# EAGLE design MrMIDI L1 (EAGLE 6.6.0)
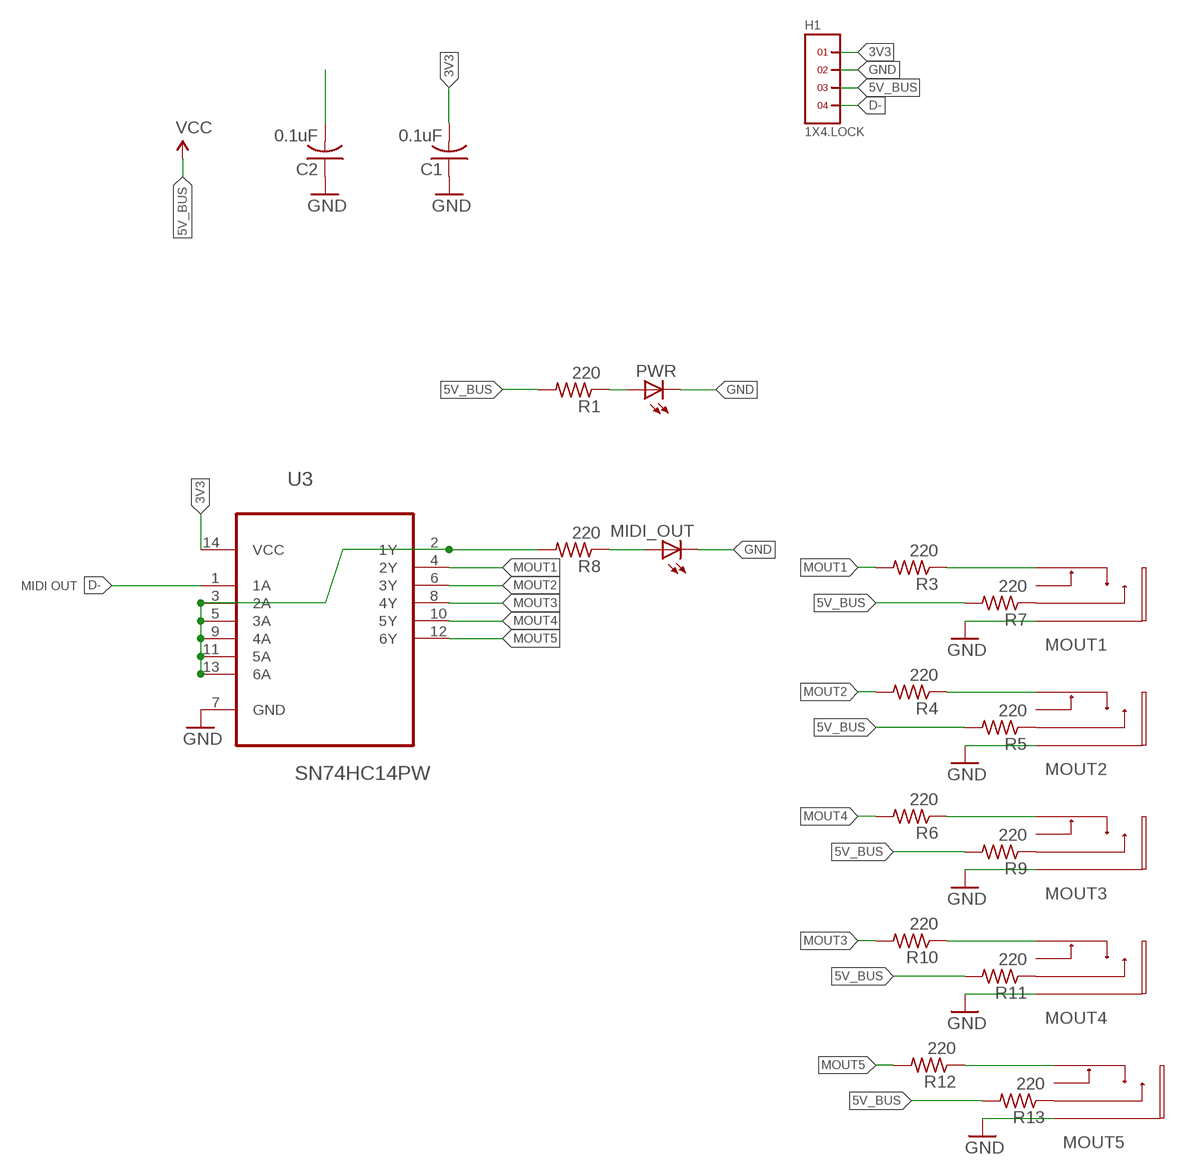
[diagram p0: schematic, sheet 1]

## Parts
C1  0.1uF  RCL_C-USC0603K  [RCL_C0603K]
C2  0.1uF  RCL_C-USC0603K  [RCL_C0603K]
H1  1X4.LOCK  [1X4.LOCK]
MIDI_OUT  LEDCHIPLED_0603  [CHIPLED_0603]
MOUT1  PJ327E  [PJ327]
MOUT2  PJ327E  [PJ327]
MOUT3  PJ327E  [PJ327]
MOUT4  PJ327E  [PJ327]
MOUT5  PJ327E  [PJ327]
PWR  LEDCHIPLED_0603  [CHIPLED_0603]
R1  220  RCL_R-US_R0402  [RCL_R0402]
R3  220  RCL_R-US_R0402  [RCL_R0402]
R4  220  RCL_R-US_R0402  [RCL_R0402]
R5  220  RCL_R-US_R0402  [RCL_R0402]
R6  220  RCL_R-US_R0402  [RCL_R0402]
R7  220  RCL_R-US_R0402  [RCL_R0402]
R8  220  RCL_R-US_R0402  [RCL_R0402]
R9  220  RCL_R-US_R0402  [RCL_R0402]
R10  220  RCL_R-US_R0402  [RCL_R0402]
R11  220  RCL_R-US_R0402  [RCL_R0402]
R12  220  RCL_R-US_R0402  [RCL_R0402]
R13  220  RCL_R-US_R0402  [RCL_R0402]
U3  SN74HC14PW  [SOP65P640X120-14N]

## Nets
3V3: C1.2 H1.1 U3.14(VCC)
5V_BUS: C2.2 H1.3 R1.2 R5.2 R7.2 R9.2 R11.2 R13.2 ; supply symbol labelled VCC
D-: H1.4 U3.1(1A)
GND: C1.1 C2.1 H1.2 MIDI_OUT.C MOUT1.P$1 MOUT1.P$4 MOUT2.P$1 MOUT2.P$4 MOUT3.P$1 MOUT3.P$4 MOUT4.P$1 MOUT4.P$4 MOUT5.P$1 MOUT5.P$4 PWR.C U3.7(GND)
MOUT1: R3.2 U3.4(2Y)
MOUT2: R4.2 U3.6(3Y)
MOUT3: R10.2 U3.8(4Y)
MOUT4: R6.2 U3.10(5Y)
MOUT5: R12.2 U3.12(6Y)
N$1: MIDI_OUT.A R8.1
N$3: MOUT5.P$3 R13.1
N$6: R8.2 U3.2(1Y) U3.3(2A) U3.5(3A) U3.9(4A) U3.11(5A) U3.13(6A)
N$7: MOUT1.P$3 R7.1
N$8: MOUT1.P$2 R3.1
N$9: MOUT2.P$3 R5.1
N$10: MOUT2.P$2 R4.1
N$11: MOUT3.P$3 R9.1
N$12: MOUT3.P$2 R6.1
N$13: MOUT4.P$3 R11.1
N$14: MOUT4.P$2 R10.1
N$17: MOUT5.P$2 R12.1
N$21: PWR.A R1.1
Unconnected: MOUT1.P$5 MOUT2.P$5 MOUT3.P$5 MOUT4.P$5 MOUT5.P$5

## Notes on the sheet
- MIDI OUT

## Library data of the parts
C1 C2 = ioboard:RCL_C-US: CAPACITOR, American symbol
H1 = headers(.1in):1X4
MIDI_OUT PWR = led:LED: LED OSRAM: - CHIPLED LG R971, LG N971, LY N971, LG Q971, LY Q971, LO R971, LY R971 LH N974, LH R974 LS Q976, LO Q976, LY Q976 LO Q996 - Hyper CHIPLED LW Q18S LB Q993, LB Q99A, LB R99A - SideLED LS A670, LO A670, LY A670, LG A670, LP A670 LB A673, LV A673, LT A673, LW A673 LH A674 LY A675 LS A676, LA A676, LO A676, LY A676, LW A676 LS A679, LY A679, LG A679 - Hyper Micro SIDELED® LS Y876, LA Y876, LO Y876, LY Y876 LT Y87S - SmartLED LW L88C, LW L88S LB L89C, LB L89S, LG L890 LS L89K, LO L89K, LY L89K LS L896, LA L896, LO L896, LY L896 - TOPLED LS T670, LO T670, LY T670, LG T670, LP T670 LSG T670, LSP T670, LSY T670, LOP T670, LYG T670 LG T671, LOG T671, LSG T671 LB T673, LV T673, LT T673, LW T673 LH T674 LS T676, LA T676, LO T676, LY T676, LB T676, LH T676, LSB T676, LW T676 LB T67C, LV T67C, LT T67C, LS T67K, LO T67K, LY T67K, LW E67C LS E67B, LA E67B, LO E67B, LY E67B, LB E67C, LV E67C, LT E67C LW T67C LS T679, LY T679, LG T679 LS T770, LO T770, LY T770, LG T770, LP T770 LB T773, LV T773, LT T773, LW T773 LH T774 LS E675, LA E675, LY E675, LS T675 LS T776, LA T776, LO T776, LY T776, LB T776 LHGB T686 LT T68C, LB T68C - Hyper Mini TOPLED® LB M676 - Mini TOPLED Santana® LG M470 LS M47K, LO M47K, LY M47K Source: http://www.osram.convergy.de LUXEON: - LUMILED® LXK2-PW12-R00, LXK2-PW12-S00, LXK2-PW14-U00, LXK2-PW14-V00 LXK2-PM12-R00, LXK2-PM12-S00, LXK2-PM14-U00 LXK2-PE12-Q00, LXK2-PE12-R00, LXK2-PE12-S00, LXK2-PE14-T00, LXK2-PE14-U00 LXK2-PB12-K00, LXK2-PB12-L00, LXK2-PB12-M00, LXK2-PB14-N00, LXK2-PB14-P00, LXK2-PB14-Q00 LXK2-PR12-L00, LXK2-PR12-M00, LXK2-PR14-Q00, LXK2-PR14-R00 LXK2-PD12-Q00, LXK2-PD12-R00, LXK2-PD12-S00 LXK2-PH12-R00, LXK2-PH12-S00 LXK2-PL12-P00, LXK2-PL12-Q00, LXK2-PL12-R00 Source: www.luxeon.com KINGBRIGHT: KA-3528ASYC Source: www.kingbright.com
MOUT1-MOUT5 = 0Raph's Lib:PJ327E
R1 R3-R13 = warps_v30:RCL_R-US_: RESISTOR, American symbol
U3 = Raph's Lib:SN74HC14PW: HEX SCHMITT-TRIGGER INVERTERS; MPN: SN74HC14PW; OC_FARNELL: 9591133; OC_NEWARK: 02H5414; PACKAGE: TSSOP-14; SUPPLIER: Texas Instruments

## Board
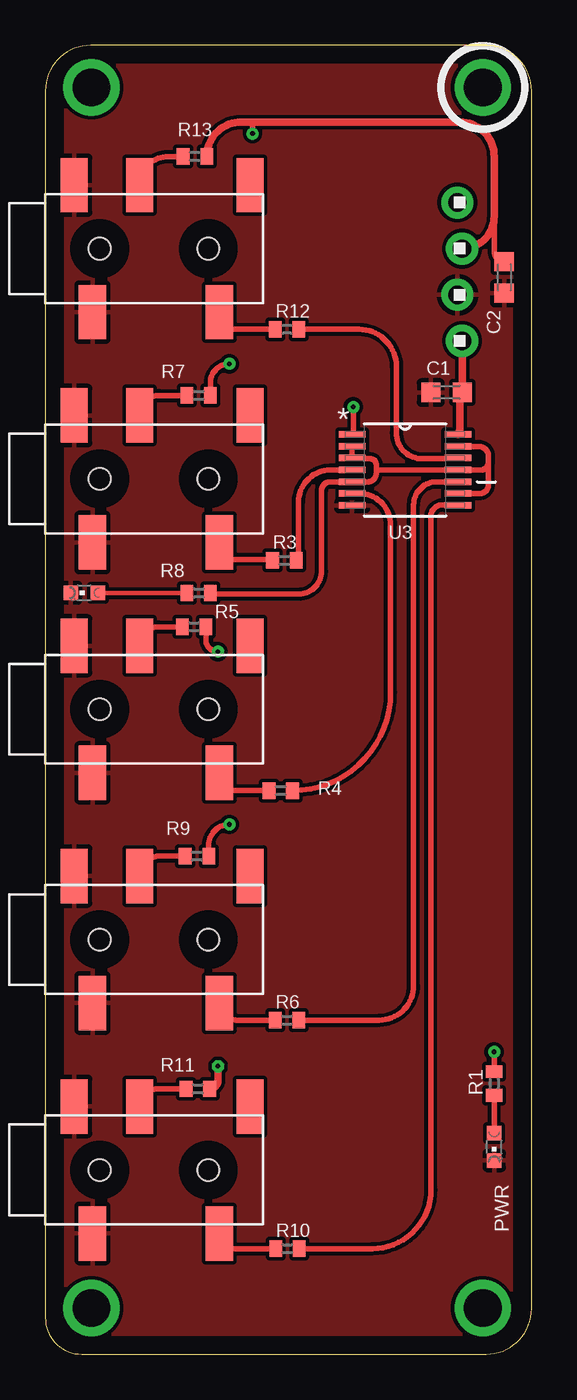
[diagram p1: board, top side]
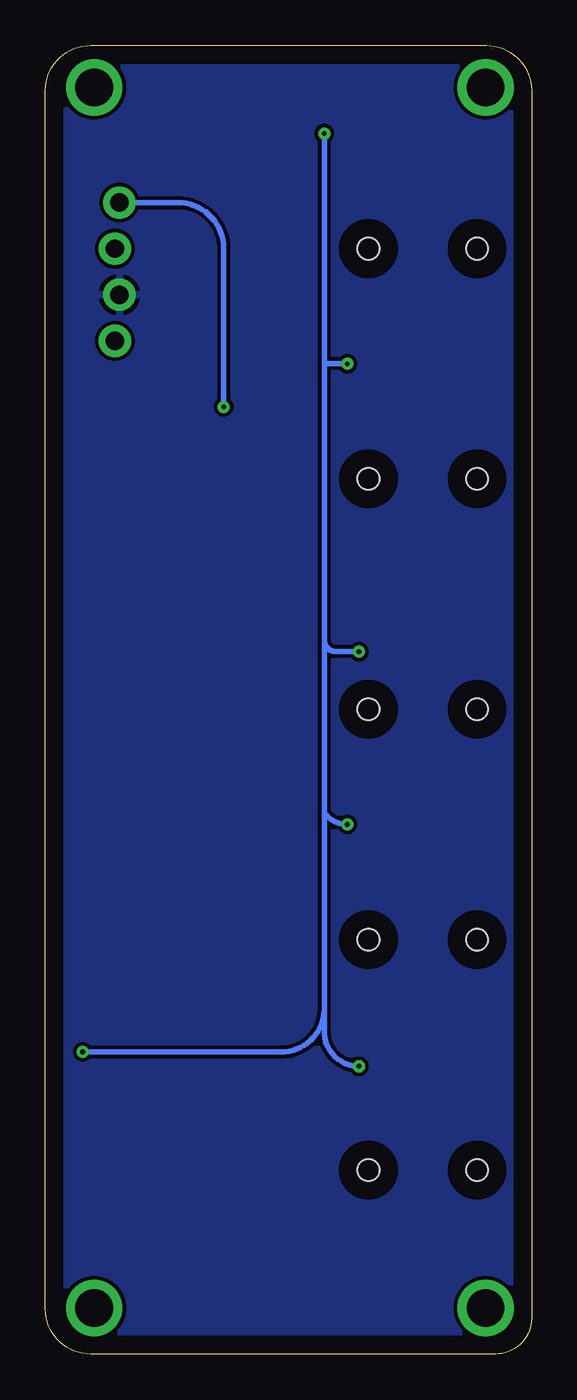
[diagram p2: board, bottom side, seen from below]

Size 26.82 x 72.17 mm. Coordinates in mm from the lower left corner, seen from the top.
Outline: 2,0 24.32,0 arc90 26.82,2.5 26.82,69.67 arc90 24.32,72.17 2.5,72.17 arc90 0,69.67 0,2 arc90 2,0
Copper layers (1*16): Top 0.035mm / dielectric 1.5mm / Bottom 0.035mm
Design rules "default": minimum track width 10mil, minimum drill 24mil, track to track 8mil, track to pad 8mil, pad to pad 8mil, via to via 8mil, smd to smd 8mil, copper to edge 40mil, drill to drill 8mil, minimum pad ring 10mil, minimum via ring 8mil, stop-mask expansion 4mil, vias tented up to drill 25mil, thermal gap 10mil

### Footprints (pad centres in the part's own frame; a part is rotated, then mirrored left to right if it is on the bottom)
RCL_C0603K = smd 1.05 x 1.08: 1 -0.875,0; 2 0.875,0
1X4.LOCK = drill 1.016 pad 1.778: 1 0,-0.127; 2 2.54,0.127; 3 5.08,-0.127; 4 7.62,0.127
CHIPLED_0603 = smd 0.8 x 0.8: A 0,-0.75; C 0,0.75
PJ327 = smd 1.5 x 3: P$1 1.6,3.5; P$2 9.6,-3.5; P$3 5.2,3.5; P$4 2.6,-3.5; P$5 11.3,3.5 | hole 1.2: 3,0; 9,0
RCL_R0402 = smd 0.7 x 0.9: 1 -0.65,0; 2 0.65,0
SOP65P640X120-14N = smd 1.473 x 0.356: 1 -2.921,1.956; 2 -2.921,1.295; 3 -2.921,0.66; 4 -2.921,0; 5 -2.921,-0.66; 6 -2.921,-1.295; 7 -2.921,-1.956; 8 2.921,-1.956; 9 2.921,-1.295; 10 2.921,-0.66; 11 2.921,0; 12 2.921,0.66; 13 2.921,1.295; 14 2.921,1.956

### Placement (x,y rotation side)
C1  22.13,53.03 0 top
C2  25.32,59.37 90 top
H1  22.86,55.88 90 top
MIDI_OUT  2.16,41.98 90 top
MOUT1  0,48.26 0 top
MOUT2  0,35.56 0 top
MOUT3  0,22.86 0 top
MOUT4  0,10.16 0 top
MOUT5  0,60.96 0 top
PWR  24.77,11.43 180 top
R1  24.77,14.92 90 top
R3  13.19,43.77 0 top
R4  12.99,31.07 0 top
R5  8.21,40.11 0 top
R6  13.34,18.42 0 top
R7  8.46,52.86 0 top
R8  8.46,41.97 0 top
R9  8.37,27.47 0 top
R10  13.36,5.82 0 top
R11  8.41,14.63 0 top
R12  13.34,56.52 0 top
R13  8.26,66.04 0 top
U3  19.85,48.75 0 top
U$1  [MSW_LOGO_0.5"]  17.11,10.73 0 top

### Tracks (layer width: path | path; a pad name or v marks a point on that pad's centre or on a via)
3V3
  Top 0.406: H1.1 23.01,55.88 C1.2 22.86,53.03 22.86,50.8 22.77,50.8 U3.14
5V_BUS  (via drill 0.25, 0.25 pad 0.3)
  Top 0.305: v11.43,67.31 11.43,67.94 | R7.2 9.11,53.56 arc-90 v10.16,54.61 | R5.2 8.86,39.41 arc90 v9.53,38.73 | R9.2 9.02,28.07 arc-90 v10.16,29.21 | C2.2 arc-90 24.77,60.8 24.77,62.74 | R1.2 v24.77,16.67
  Top 0.406: R13.2 arc-90 10.81,67.94 11.43,67.94 22.86,67.94 arc-90 24.77,66.04 24.77,62.74 arc-90 H1.3 | R11.2 arc90 9.53,15.09 v9.53,15.87
  Bottom 0.305: v9.53,15.87 arc90 11.43,17.78 11.43,19.05 | 11.43,19.05 11.43,29.85 | 11.43,29.85 11.43,39.37 | 11.43,39.37 11.43,54.61 | 11.43,54.61 v11.43,67.31 | v10.16,54.61 11.43,54.61 | v9.53,38.73 10.79,38.73 arc90 11.43,39.37 | v10.16,29.21 arc53 11.43,29.85 | v24.77,16.67 13.81,16.67 arc-90 11.43,19.05
D-  (via drill 0.25)
  Top 0.305: v16.99,52.23 16.99,50.77 arc-90 U3.1
  Bottom 0.305: H1.4 19.53,63.5 arc90 16.99,60.96 v16.99,52.23
GND
  pour Top: 0,77.47 27.94,77.47 27.94,-6.35 0,-6.35
  pour Bottom: -10.16,76.2 33.02,76.2 33.02,-5.08 -10.16,-5.08
MOUT1
  Top 0.305: R3.2 arc90 13.97,43.9 13.97,46.99 arc-90 15.73,48.75 U3.4
MOUT2
  Top 0.305: R4.2 arc90 19.05,36.49 19.05,45.72 arc90 17.31,47.46 U3.6
MOUT3
  Top 0.305: R10.2 18.04,5.82 arc90 21.27,9.05 21.27,46.2 arc-90 21.91,46.83 22.73,46.83 arc-90 U3.8
MOUT4
  Top 0.305: R6.2 18.41,18.42 arc90 20.32,20.32 20.32,46.83 arc-90 21.59,48.1 22.76,48.1 arc-90 U3.10
MOUT5
  Top 0.305: R12.2 17.3,56.52 arc-90 19.37,54.45 19.37,50.8 arc90 20.8,49.37 22.72,49.37 arc90 U3.12
N$1
  Top 0.254: MIDI_OUT.A 7.81,41.98
  Top 0.406: 7.81,41.98 R8.1
N$2  (via drill 2.08)
  other vias: 2.54,69.85
N$3
  Top 0.305: MOUT5.P$3 arc-90 6.78,66.04 R13.1
N$4  (via drill 2.08)
  other vias: 24.13,69.85
N$6
  Top 0.305: R8.2 arc90 9.17,41.91 13.97,41.91 arc90 15.24,43.18 15.24,47.62 arc-90 15.72,48.1 16.92,48.1 arc-90 U3.5 17.77,48.09 arc90 18.26,48.58 18.26,48.74 | 18.26,48.74 18.26,49.05 arc90 17.94,49.37 16.97,49.37 arc-90 U3.3 U3.2 | 18.26,48.74 arc-90 18.27,48.75 U3.11 arc90 22.79,48.74 23.97,48.74 arc90 24.45,49.21 | U3.13 23.93,50.05 arc-90 24.45,49.53 24.45,49.21 | U3.9 23.96,47.46 arc90 24.45,47.94 24.45,49.21
N$7
  Top 0.305: MOUT1.P$3 arc-90 6.3,52.86 R7.1
N$8
  Top 0.305: R3.1 arc90 12.49,43.81 9.53,43.81 arc90 9.6,43.89 MOUT1.P$2
N$9
  Top 0.305: MOUT2.P$3 arc-90 6.25,40.1 R5.1
N$10
  Top 0.305: MOUT2.P$2 arc90 10.59,31.07 R4.1
N$11
  Top 0.305: MOUT3.P$3 arc-90 6.31,27.47 R9.1
N$12
  Top 0.305: MOUT3.P$2 arc90 10.54,18.42 R6.1
N$13
  Top 0.305: MOUT4.P$3 arc-90 6.17,14.63 R11.1
N$14
  Top 0.305: MOUT4.P$2 arc90 10.44,5.82 R10.1
N$16  (via drill 2.08)
  other vias: 2.54,2.54
N$17
  Top 0.305: MOUT5.P$2 arc90 10.54,56.52 R12.1
N$18  (via drill 2.08)
  other vias: 24.13,2.54
N$21
  Top 0.305: PWR.A R1.1

### Text on the board
bDocu: THIS IS NOT / A USB PORT | MiSTer MIDI Breakout / MiSW 2023